# EAGLE design BleAx_nRF52832 (EAGLE 8.0.1)

## Sheet 1 of 2
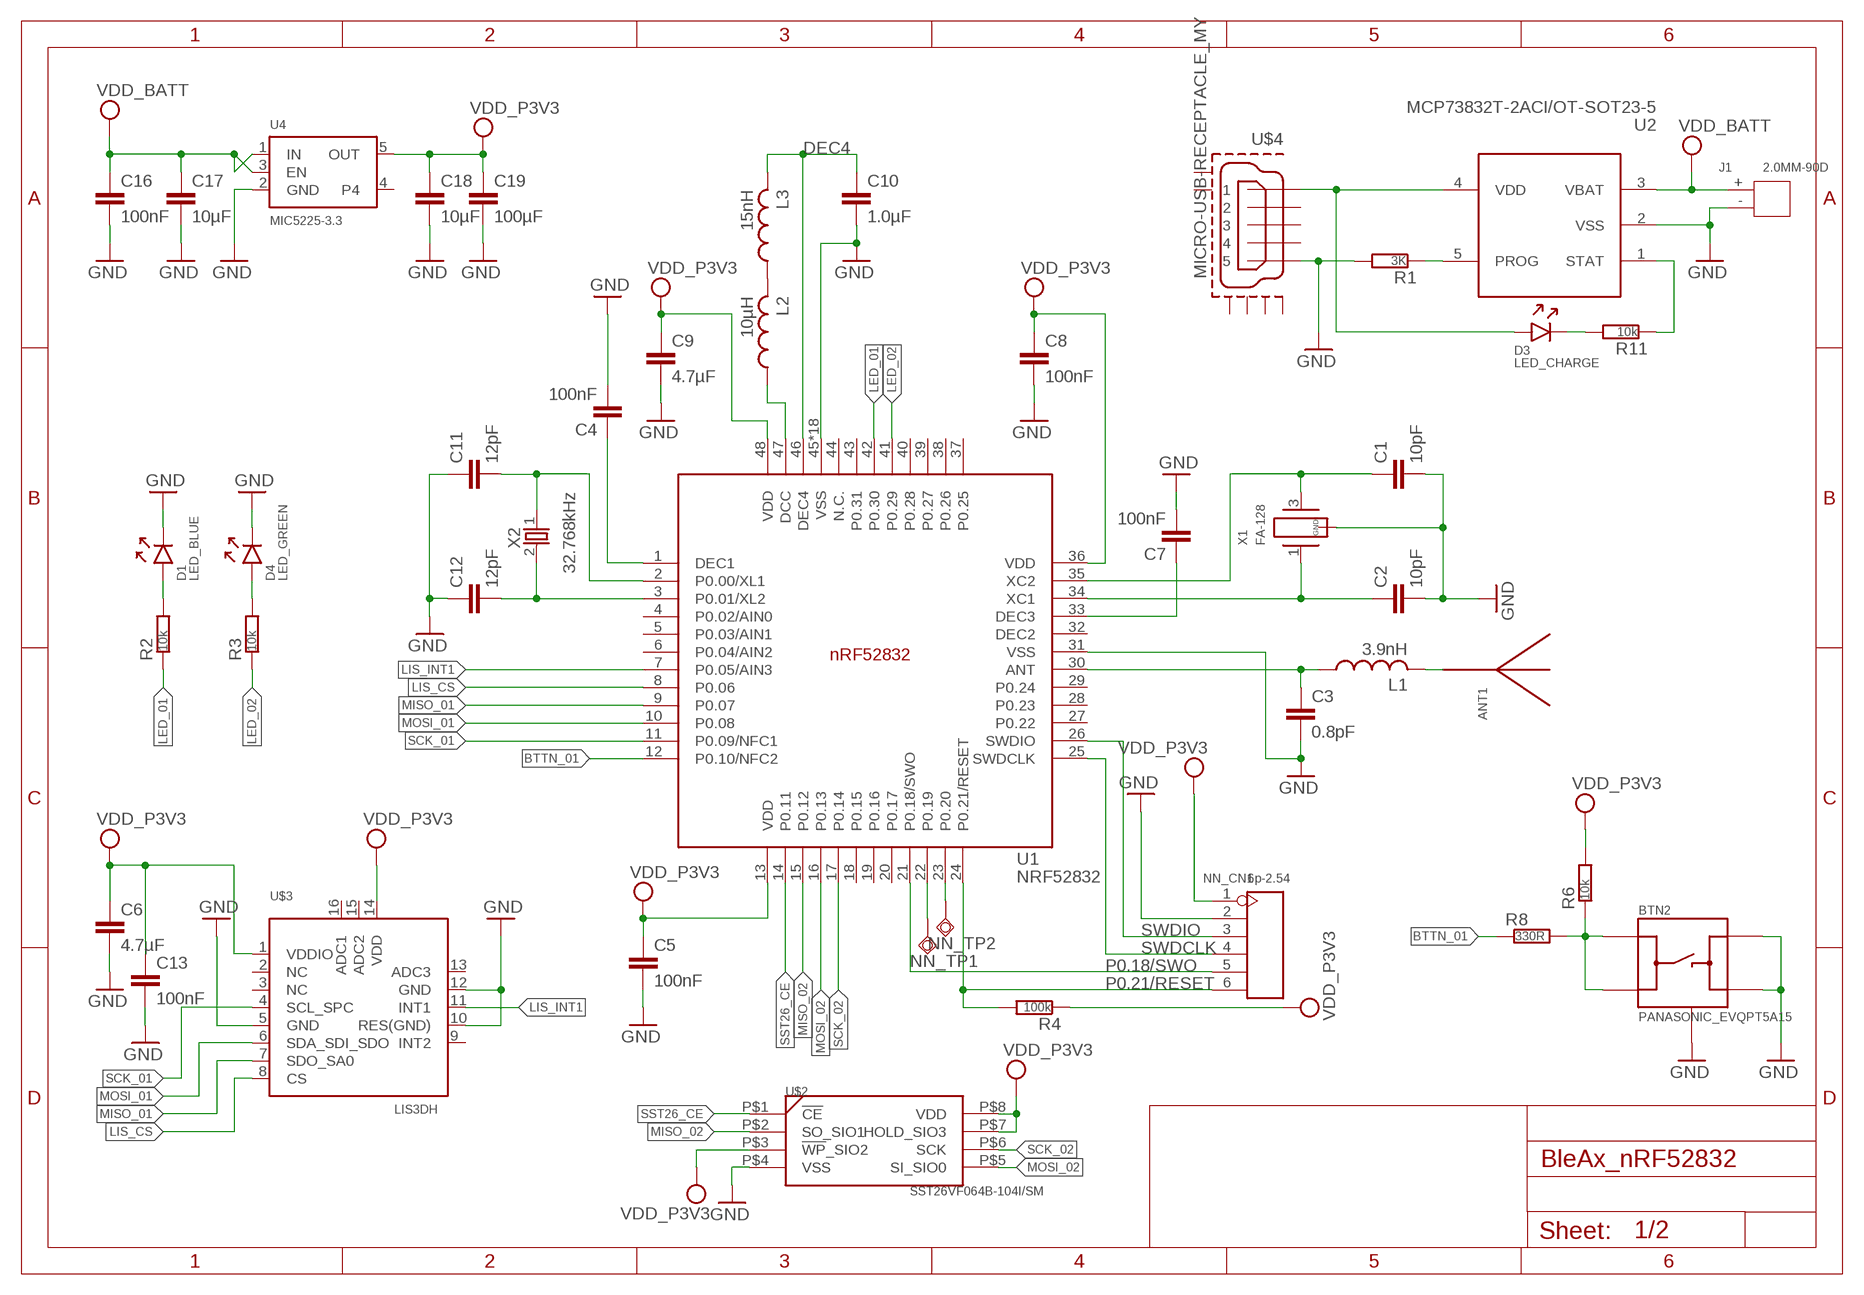
[diagram p0: schematic, sheet 1]

### Parts
ANT1  ANTENNA_QUARTER-WAVE_MONOPOLE_MEANDERED_LEFT  [QWMP_MEANDERED_LEFT_+6]
BTN2  PANASONIC_EVQPT5A15  [PANASONIC_EVQPT5A15]
C1  10pF  CAPACITOR_0402_N  [RESC0402_N]
C2  10pF  CAPACITOR_0402_N  [RESC0402_N]
C3  0.8pF  CAPACITOR_0402_N  [RESC0402_N]
C4  100nF  CAPACITOR_0402_N  [RESC0402_N]
C5  100nF  CAPACITOR_0402_N  [RESC0402_N]
C6  4.7µF  CAPACITOR_0603_N  [RESC0603_N]
C7  100nF  CAPACITOR_0402_N  [RESC0402_N]
C8  100nF  CAPACITOR_0402_N  [RESC0402_N]
C9  4.7µF  CAPACITOR_0603_N  [RESC0603_N]
C10  1.0µF  CAPACITOR_0603_N  [RESC0603_N]
C11  12pF  CAPACITOR_0402_N  [RESC0402_N]
C12  12pF  CAPACITOR_0402_N  [RESC0402_N]
C13  100nF  CAPACITOR_0402_N  [RESC0402_N]
C16  100nF  CAPACITOR_0402_N  [RESC0402_N]
C17  10µF  CAPACITOR_0603_N  [RESC0603_N]
C18  10µF  CAPACITOR_0603_N  [RESC0603_N]
C19  100µF  CAPACITOR_0805_N  [RESC0805_N]
D1  LED_BLUE  LED  [DIOC0603_N]
D3  LED_CHARGE  LED  [DIOC0603_N]
D4  LED_GREEN  LED  [DIOC0603_N]
J1  2.0MM-90D  CONN-HEADER-PH-SIDE-(2P-2.0MM)'90D'  [H2-2.0-90D]
L1  3.9nH  INDUCTOR_0402_N  [RESC0402_N]
L2  10µH  INDUCTOR_0603_N  [RESC0603_N]
L3  15nH  INDUCTOR_0402_N  [RESC0402_N]
NN_CN1  6p-2.54  DIP-BLACK-FEMALE-HEADER-VERT(6P-2.54)  [H6-2.54]
NN_TP1  TPSQTP08R  [TP08R]
NN_TP2  TPSQTP08R  [TP08R]
R1  3K  RESISTOR_0402_N  [RESC0402_N]
R2  10k  RESISTOR_0402_N  [RESC0402_N]
R3  10k  RESISTOR_0402_N  [RESC0402_N]
R4  100k  RESISTOR_0402_N  [RESC0402_N]
R6  10k  RESISTOR_0402_N  [RESC0402_N]
R8  330R  RESISTOR_0402_N  [RESC0402_N]
R11  10k  RESISTOR_0402_N  [RESC0402_N]
U1  NRF52832  [QFN40P600X600X90-48_N]
U2  MCP73832T-2ACI/OT-SOT23-5  PMIC-MCP73832T-2ACI/OT(SOT23-5)  [SOT-23-5]
U4  MIC5225-3.3  VREG_SOT23-5  [SOT23-5]
U$2  SST26VF064B-104I/SM  SST26VF  [SOIJ8]
U$3  LIS3DH  ACCEL_LIS3DHTR  [LGA16_3X3MM]
U$4  MICRO-USB-RECEPTACLE_MY  [47589-0001_MY]
X1  FA-128  [FA-128]
X2  32.768kHz  XTAL_32KHZ  [XTAL_3215_N]

### Nets
ANT: C3.1 L1.1 U1.30(ANT)
BTTN_01: R8.1 U1.12(P0.10/NFC2)
DEC3: C7.1 U1.33(DEC3)
DEC4: C10.1 L3.2 U1.46(DEC4)
GND: BTN2.3(B) BTN2.4(B') BTN2.5(GND) BTN2.6(GND) C1.2 C2.2 C3.2 C4.2 C5.2 C6.2 C7.2 C8.2 C9.2 C10.2 C11.1 C12.1 C13.2 C16.2 C17.2 C18.2 C19.2 D1.1(C) D4.1(C) J1.- NN_CN1.2 R1.2 U1.31(VSS) U1.45(VSS) U1.PAD(VSS) U1.PAD@VIA01(VSS) U1.PAD@VIA02(VSS) U1.PAD@VIA03(VSS) U1.PAD@VIA04(VSS) U1.PAD@VIA05(VSS) U1.PAD@VIA06(VSS) U1.PAD@VIA07(VSS) U1.PAD@VIA08(VSS) U1.PAD@VIA09(VSS) U1.PAD@VIA10(VSS) U1.PAD@VIA11(VSS) U1.PAD@VIA12(VSS) U1.PAD@VIA13(VSS) U1.PAD@VIA14(VSS) U1.PAD@VIA15(VSS) U1.PAD@VIA16(VSS) U2.2(VSS) U4.2(GND) U$2.P$4(VSS) U$3.5(GND) U$3.10(RES(GND)) U$3.12(GND) U$4.5 X1.2(GND) X1.4(GND)
LED_01: R2.1 U1.42(P0.30)
LED_02: R3.1 U1.41(P0.29)
LIS_CS: U1.8(P0.06) U$3.8(CS)
LIS_INT1: U1.7(P0.05/AIN3) U$3.11(INT1)
MISO_01: U1.9(P0.07) U$3.7(SDO_SA0)
MISO_02: U1.15(P0.12) U$2.P$2(SO_SIO1)
MOSI_01: U1.10(P0.08) U$3.6(SDA_SDI_SDO)
MOSI_02: U1.16(P0.13) U$2.P$5(SI_SIO0)
N$1: R1.1 U2.5(PROG)
N$2: L2.2 L3.1
N$3: C1.1 U1.35(XC2) X1.3
N$4: L2.1 U1.47(DCC)
N$5: ANT1.P$1 L1.2
N$6: BTN2.1(A) BTN2.2(A') R6.1 R8.2
N$7: D1.2(A) R2.2
N$8: D4.2(A) R3.2
N$9: D3.1(C) R11.2
N$10: R11.1 U2.1(STAT)
N$11: NN_TP1.TP U1.22(P0.19)
N$12: NN_TP2.TP U1.23(P0.20)
N$13: C4.1 U1.1(DEC1)
P0.18/SWO: NN_CN1.5 U1.21(P0.18/SWO)
P0.21/RESET: NN_CN1.6 R4.2 U1.24(P0.21/RESET)
SCK_01: U1.11(P0.09/NFC1) U$3.4(SCL_SPC)
SCK_02: U1.17(P0.14) U$2.P$6(SCK)
SST26_CE: U1.14(P0.11) U$2.P$1(!CE)
SWDCLK: NN_CN1.4 U1.25(SWDCLK)
SWDIO: NN_CN1.3 U1.26(SWDIO)
VCC_P5V0_USB: D3.2(A) U2.4(VDD) U$4.1
VDD_BATT: C16.1 C17.1 J1.+ U2.3(VBAT) U4.1(IN) U4.3(EN)
VDD_P3V3: C5.1 C6.1 C8.1 C9.1 C13.1 C18.1 C19.1 NN_CN1.1 R4.1 R6.2 U1.13(VDD) U1.36(VDD) U1.48(VDD) U4.5(OUT) U$2.P$3(!WP!_SIO2) U$2.P$7(HOLD_SIO3) U$2.P$8(VDD) U$3.1(VDDIO) U$3.14(VDD)
X1: C2.1 U1.34(XC1) X1.1
XL1: C11.2 U1.2(P0.00/XL1) X2.1
XL2: C12.2 U1.3(P0.01/XL2) X2.2
Unconnected: U1.4(P0.02/AIN0) U1.5(P0.03/AIN1) U1.6(P0.04/AIN2) U1.18(P0.15) U1.19(P0.16) U1.20(P0.17) U1.27(P0.22) U1.28(P0.23) U1.29(P0.24) U1.32(DEC2) U1.37(P0.25) U1.38(P0.26) U1.39(P0.27) U1.40(P0.28) U1.43(P0.31) U1.44(N.C.) U4.4 U$3.2(NC) U$3.3(NC) U$3.9(INT2) U$3.13(ADC3) U$3.15(ADC2) U$3.16(ADC1) U$4.2 U$4.3 U$4.4 U$4.P$1(GND1) U$4.P$2(GND2) U$4.P$3(GND3) U$4.P$4(GND4) U$4.P$5(GND5) U$4.P$6(GND6)

## Sheet 2 of 2
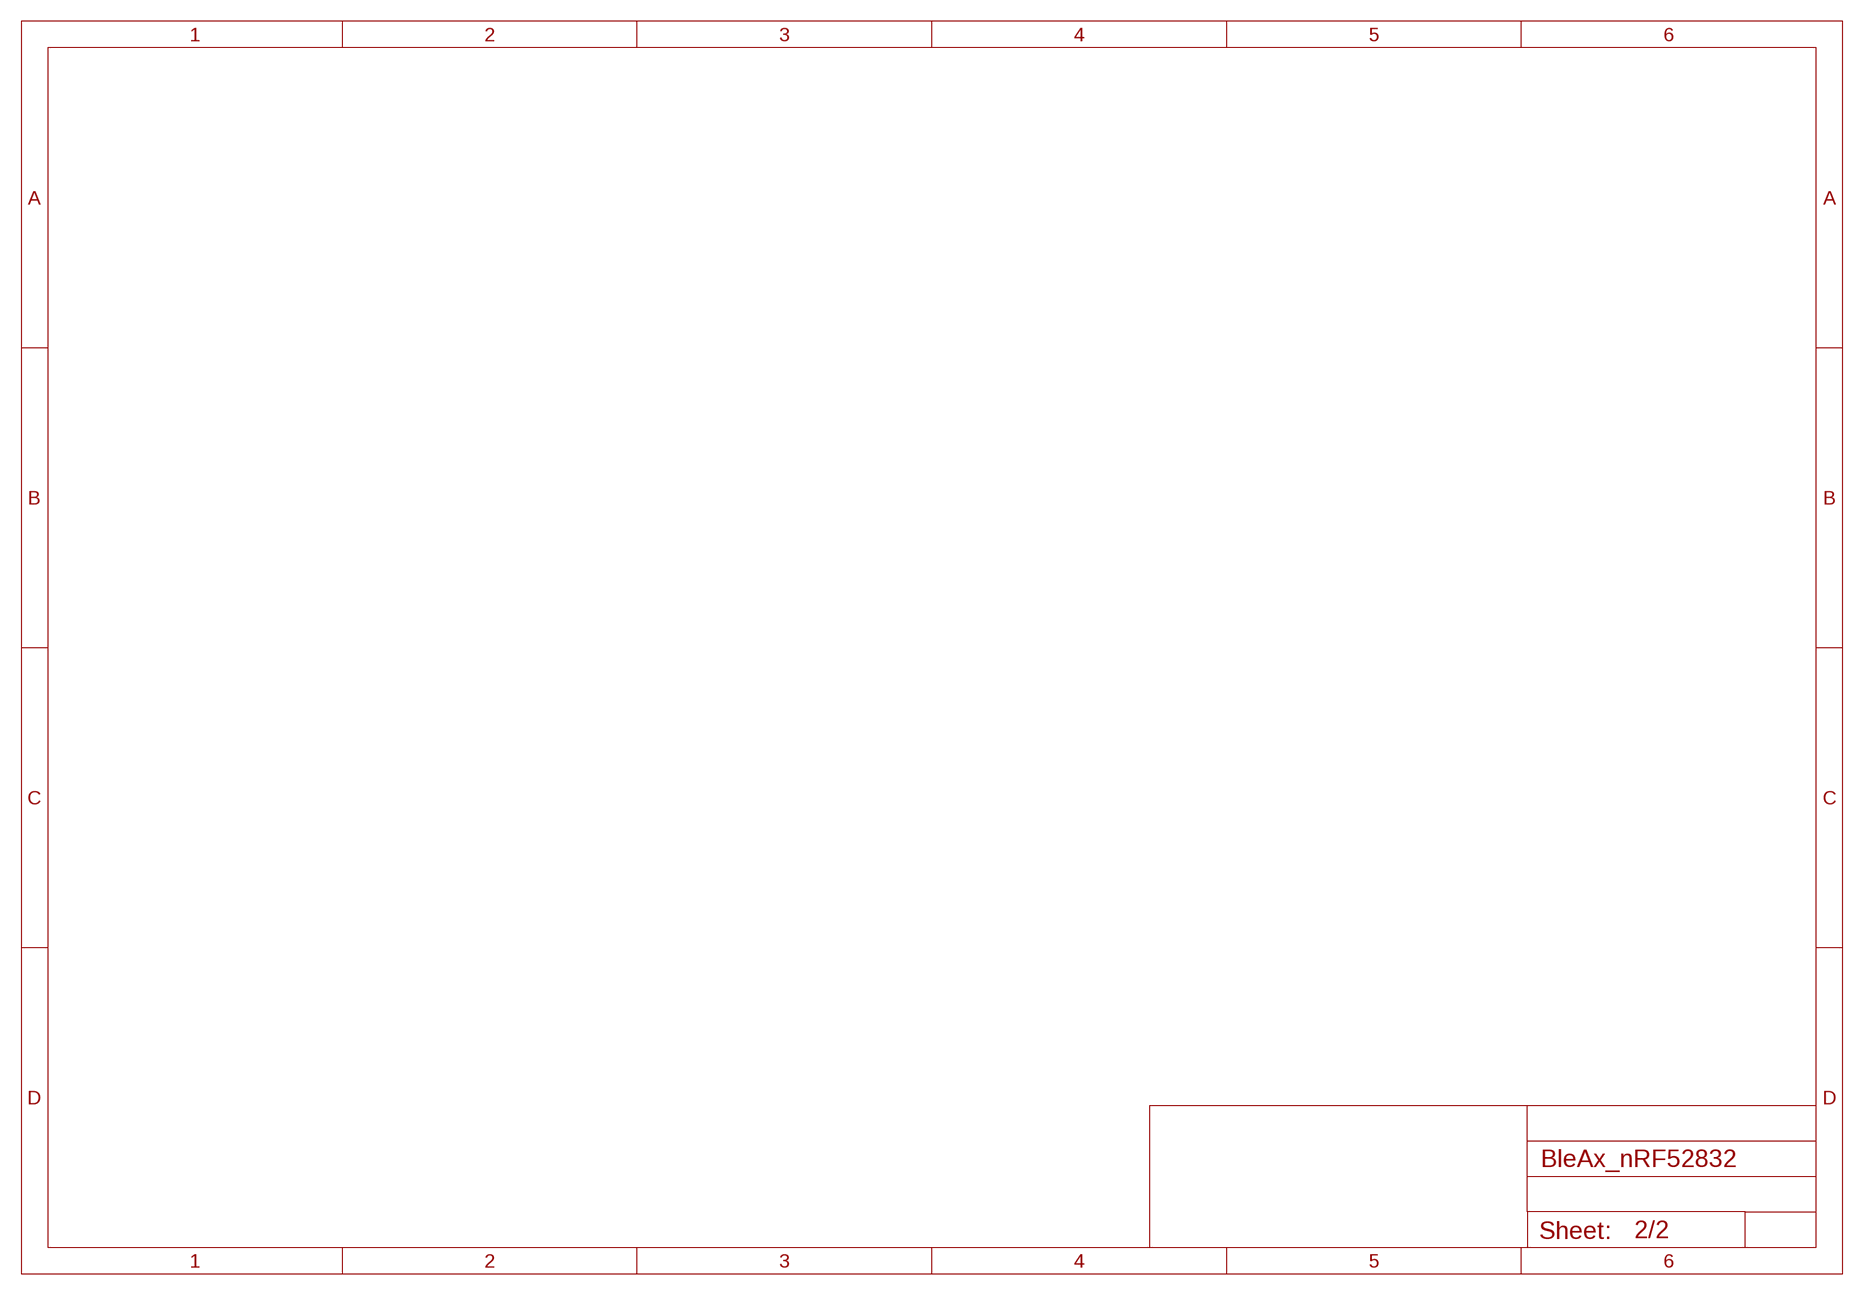
[diagram p1: schematic, sheet 2]

## Library data of the parts
ANT1 = Nordic_misc:ANTENNA_QUARTER-WAVE_MONOPOLE_MEANDERED_LEFT
BTN2 = Nordic_misc:PANASONIC_EVQPT5A15
C1-C13 C16-C19 = Nordic_misc:CAPACITOR: Generic chip capacitor
D1 D3 D4 = Nordic_misc:LED
J1 = Seeed-OPL-Connector:CONN-HEADER-PH-SIDE-(2P-2.0MM): 320110027
L1-L3 = Nordic_misc:INDUCTOR: Generic chip inductor
NN_CN1 = Seeed-OPL-Connector:DIP-BLACK-FEMALE-HEADER-VERT(6P-2.54): 320030060; MPN: F185-1106A1BSYC1
NN_TP1 NN_TP2 = testpad:TPSQ: Test pad
R1-R4 R6 R8 R11 = Nordic_misc:RESISTOR: Generic chip resistor
U1 = Nordic_nRF:NRF52832: nRF52832 Features Single chip, highly flexible, 2.4 GHz multi-protocol SoC 32-bit ARM Cortex-M4F Processor 1.7v to 3.6v operation 512kB flash + 64kB RAM Supports concurrent Bluetooth Smart/ANT protocol operation On-chip NFC tag for Out-of-Band (OOB) pairing Up to +4dBm output power -96dBm sensitivity, Bluetooth Smart Thread safe and run-time protected Event driven API On air compatible with nRF24L and nRF24AP series 2 data rates (2Mbps/1Mbps) PPI - maximum flexibility for power-efficient applications and code simplification Automated power management system with automatic power management of each peripheral Configurable I/O mapping for analog and digital I/O 3 x Master/Slave SPI 2 x Two-wire interface (I²C) UART (RTS/CTS) 3 x PWM AES HW encryption Real Time Counter (RTC) Digital microphone interface (PDM) On-chip balun Applications Internet of Things (IoT) Wearables SmartHome sensors Connected white goods Computer peripherals Voice-command smart remotes A4WP ‘Rezence’ wireless charging Beacons Sports and fitness sensors and hubs Connected health products Smart watches RC Toys Interactive games Building automation and sensor networks
U2 = Seeed-OPL-ic:PMIC-MCP73832T-2ACI/OT(SOT23-5): 310030238; MPN: MCP73832T-2ACI/OT
U4 = microbuilder:VREG_SOT23-5: SOT23-5 Fixed Voltage Regulators To better organise some of the SOT23-5 fixed voltage regulators in this library, this new part was created. Part Current Out V Out V In V Dropout Digikey Part No. ADP121 150mA 3.3V 3.4-5.5V 0.09V @ 150mA ADP121-AUJZ33R7CT-ND ADP121 150mA 3.0V 3.1-5.5V 0.09V @ 150mA ADP121-AUJZ30R7CT-ND ADP122 300mA 3.3V 3.4-5.5V 0.085V @ 300mA ADP122AUJZ-3.3-R7CT-ND ADP1712 300mA 3.3V 3.5-5.5V 0.17V @ 300mA ADP1712AUJZ-3.3-R7TR-ND AP7311 (Low Cost) 150mA 3.3V 3.5-6V 0.15V @ 150mA AP7311-33WG-7DICT-ND LD39015M18R 150mA 1.8V 1.9V-5.5V 0.08V @ 100mA 497-6977-1-ND MCP1824T-3302E/OT 300mA 3.3V 3.5V-6V 0.2V @ 300mA MCP1824T-3302E/OTCT-ND MIC5205-2.5YM5 TR 150mA 2.5V 2.7-16V 0.165V @ 150mA 576-1257-2-ND MIC5205-3.0YM5 TR 150mA 3.0V 3.2V-16V 0.165V @ 150mA 576-1258-2-ND MIC5205-3.3YM5 TR 150mA 3.3V 3.5V-16V 0.165V @ 150mA 576-1259-2-ND TPS780330220 150mA 3.3V+2.2V 3.6-5.5V 250mV Max 296-23332-1-ND TDA3663/N1,135 100mA 3.3V 3.5-45V 0.18V @ 50mA 568-5343-1-ND
U$2 = sst26:SST26VF: SST26VF SST26
U$3 = microbuilder:ACCEL_LIS3DHTR: LIS3DHTR 3-Axis Accelerometer with I2C/SPI Interface VDD: 1.71-3.6V VDDIO: 1.71-VDD+0.1V Scale: +/-2g, 4g, 8g, 16g with 16--bit data output Temp:: -40°C - 85°C Mouser: 511-LIS3DHTR Digikey: 497-10613-1-ND
U$4 = con-molex-usb_my:MICRO-USB-RECEPTACLE_MY: MICRO USB RECEPTACLES Micro-USB Receptacles, SMT, Lead-Free from MOLEX <http://www.molex.com/>. (C) 2014 Tomasz Boleslaw CEDRO, cederom@tlen.pl, http://www.tomek.cedro.info. Version 0.1 (2014-01-17): Initial release. Version 0.2 (2014-02-06): Updated 47589-0001 footprint pins/pads/milling. Following devices are included: 1. 47589-0001 Micro-USB AB Receptacle, Bottom Mount, SMT, Lead-Free <http://www.molex.com/molex/products/datasheet.jsp?part=active/0475890001_IO_CONNECTORS.xml> (Technical Drawing <http://www.molex.com/pdm_docs/sd/475890001_sd.pdf>).
X1 = crystals:FA-128: Epson MHz RANGE CRYSTAL UNIT ULTRA MINIATURE SIZE LOW PROFILE SMD http://www.digikey.com/product-search/en?FV=ffec63d1
X2 = Nordic_nRF:XTAL_32KHZ

## Net classes
0 default: clearance 0.205 mm

## Board
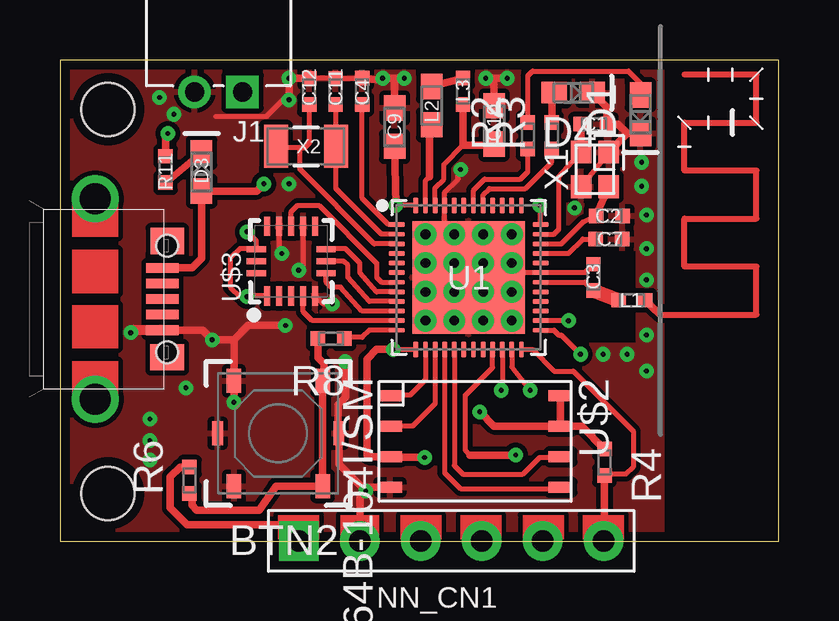
[diagram p2: board, top side]
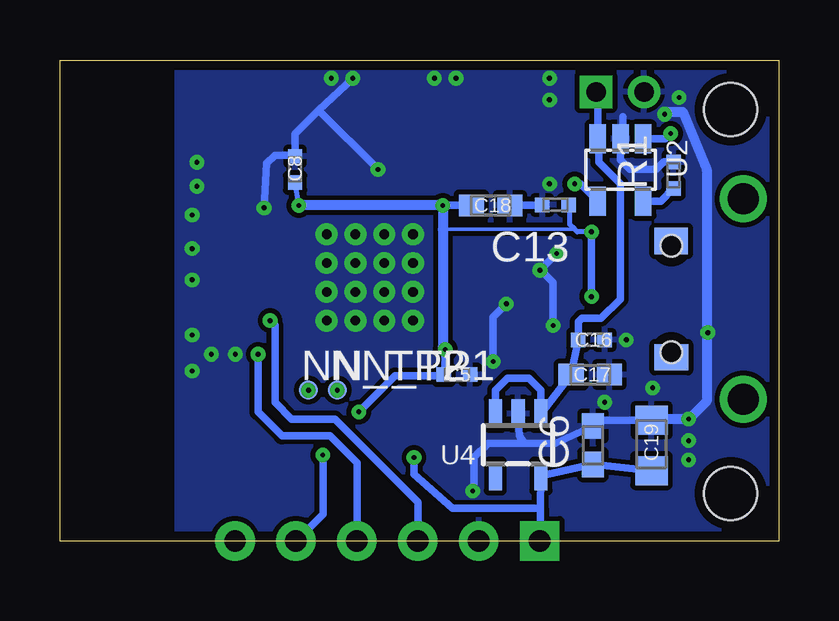
[diagram p3: board, bottom side, seen from below]

Size 29.96 x 20.06 mm. Coordinates in mm from the lower left corner, seen from the top.
Outline: 0,0 29.96,0 29.96,20.06 0,20.06 0,0
Copper layers (1*16): Top 0.035mm / dielectric 1.5mm / Bottom 0.035mm
Design rules "Nordic *": minimum track width 0.15mm, minimum drill 0.2mm, track to track 0.15mm, track to pad 0.15mm, pad to pad 0.15mm, via to via 0.15mm, smd to smd 0.15mm, copper to edge 0.4mm, drill to drill 0.4mm, minimum pad ring 10mil, minimum via ring 8mil, stop-mask expansion 0.1mm, vias tented up to drill 0.41mm, thermal gap 0.2mm
Holes 2.2 mm at 2,18 2,2
tRestrict: area 19.4,8.3 to 23,12.1; area 23,8.3 to 24,12.1

### Footprints (pad centres in the part's own frame; a part is rotated, then mirrored left to right if it is on the bottom)
QWMP_MEANDERED_LEFT_+6 = smd 0.254 x 0.254: P$1 0,0
PANASONIC_EVQPT5A15 = smd 0.6 x 1: 1 -1.85,2.2; 2 -1.85,-2.2; 3 1.85,2.2; 4 1.85,-2.2 | smd 0.45 x 1: 5 -2.525,0; 6 2.525,0
RESC0402_N = smd 0.6 x 0.6: 1 -0.55,0; 2 0.55,0
RESC0603_N = smd 1.05 x 0.9: 1 -0.8,0; 2 0.8,0
RESC0805_N = smd 1.2 x 1.35: 1 -1.1,0; 2 1,0
DIOC0603_N = smd 1.05 x 0.9: 1 -0.8,0; 2 0.8,0
H2-2.0-90D = drill 0.8 pad 1.35 square: + -1,3.25 | drill 0.8 pad 1.35: - 1,3.25
H6-2.54 = drill 0.889 pad 1.651 square: 1 0,6.35 | drill 0.889 pad 1.651: 2 0,3.81; 3 0,1.27; 4 0,-1.27; 5 0,-3.81; 6 0,-6.35
TP08R = smd 0.8 x 0.8: TP 0,0
QFN40P600X600X90-48_N = smd 0.65 x 0.2: 1 -3,2.2; 2 -3,1.8; 3 -3,1.4; 4 -3,1; 5 -3,0.6; 6 -3,0.2; 7 -3,-0.2; 8 -3,-0.6; 9 -3,-1; 10 -3,-1.4; 11 -3,-1.8; 12 -3,-2.2; 25 3,-2.2; 26 3,-1.8; 27 3,-1.4; 28 3,-1; 29 3,-0.6; 30 3,-0.2; 31 3,0.2; 32 3,0.6; 33 3,1; 34 3,1.4; 35 3,1.8; 36 3,2.2 | smd 0.2 x 0.65: 13 -2.2,-3; 14 -1.8,-3; 15 -1.4,-3; 16 -1,-3; 17 -0.6,-3; 18 -0.2,-3; 19 0.2,-3; 20 0.6,-3; 21 1,-3; 22 1.4,-3; 23 1.8,-3; 24 2.2,-3; 37 2.2,3; 38 1.8,3; 39 1.4,3; 40 1,3; 41 0.6,3; 42 0.2,3; 43 -0.2,3; 44 -0.6,3; 45 -1,3; 46 -1.4,3; 47 -1.8,3; 48 -2.2,3 | smd 4.7 x 4.7: PAD 0,0 | drill 0.4: PAD@VIA01 -1.8,1.8; PAD@VIA02 -1.8,0.6; PAD@VIA03 -1.8,-0.6; PAD@VIA04 -1.8,-1.8; PAD@VIA05 -0.6,1.8; PAD@VIA06 -0.6,0.6; PAD@VIA07 -0.6,-0.6; PAD@VIA08 -0.6,-1.8; PAD@VIA09 0.6,1.8; PAD@VIA10 0.6,0.6; PAD@VIA11 0.6,-0.6; PAD@VIA12 0.6,-1.8; PAD@VIA13 1.8,1.8; PAD@VIA14 1.8,0.6; PAD@VIA15 1.8,-0.6; PAD@VIA16 1.8,-1.8
SOT-23-5 = smd 0.69 x 1.2: 1 -0.95,-1.3; 2 0,-1.3; 3 0.95,-1.3; 4 0.95,1.3; 5 -0.95,1.3
SOT23-5 = smd 0.55 x 1.2: 1 -0.95,-1.3; 2 0,-1.3; 3 0.95,-1.3; 4 0.95,1.3; 5 -0.95,1.3
SOIJ8 = smd 0.45 x 1: P$1 -1.97,-3.73; P$2 -0.7,-3.73; P$3 0.57,-3.73; P$4 1.84,-3.73; P$5 1.84,3.37; P$6 0.57,3.37; P$7 -0.7,3.37; P$8 -1.97,3.37
LGA16_3X3MM = smd 0.8 x 0.25: 1 -1.45,1; 2 -1.45,0.5; 3 -1.45,0; 4 -1.45,-0.5; 5 -1.45,-1; 9 1.45,-1; 10 1.45,-0.5; 11 1.45,0; 12 1.45,0.5; 13 1.45,1 | smd 0.25 x 0.8: 6 -0.5,-1.45; 7 0,-1.45; 8 0.5,-1.45; 14 0.5,1.45; 15 0,1.45; 16 -0.5,1.45
47589-0001_MY = smd 1.35 x 0.4: 1 4.07,1.3; 2 4.07,0.65; 3 4.07,0; 4 4.07,-0.65; 5 4.07,-1.3 | drill 1.3: P$1 1.27,4.175; P$2 1.27,-4.175 | smd 1.4 x 1.1: P$3 4.27,-2.425; P$4 4.275,2.42 | smd 1.4 x 1.1 bottom: P$5 4.27,-2.425; P$6 4.275,2.42 | hole 0.9: 4.275,2.22; 4.27,-2.225
FA-128 = smd 0.95 x 0.85: 1 -0.725,-0.575; 2 0.725,-0.575; 3 0.725,0.575; 4 -0.725,0.575
XTAL_3215_N = smd 1 x 1.8: 1 -1.25,0; 2 1.25,0

### Placement (x,y rotation side)
ANT1  25.04,9.45 0 top
BTN2  9.1,4.5 180 top
C1  22.25,17.39 0 top
C2  22.9,13.56 0 top
C3  22.24,11 90 top
C4  12.6,18.76 90 top
C5  13.41,6.95 0.1 bottom
C6  7.74,4.01 90 bottom
C7  22.89,12.6 0 top
C8  20.16,15.5 90 bottom
C9  13.95,17.26 90 top
C10  18.1,17.36 90 top
C11  11.49,18.75 270 top
C12  10.39,18.75 270 top
C13  9.3,14.02 180 bottom
C16  7.8,8.4 0 bottom
C17  7.85,6.95 0 bottom
C18  12,14 0 bottom
C19  5.3,4.05 90 bottom
D1  24.2,17.8 90 top
D3  5.9,15.4 270 top
D4  21.4,18.7 180 top
J1  6.61,21.98 180 top
L1  23.84,10.05 0 top
L2  15.5,18.16 90 top
L3  16.8,18.76 270 top
NN_CN1  16.31,0.02 90 top
NN_TP1  18.4,6.3 0 bottom
NN_TP2  19.6,6.3 0 bottom
R1  4.38,15.26 90 bottom
R2  19.5,16.9 90 top
R3  20.5,16.9 90 top
R4  22.7,3.3 270 top
R6  5.4,2.55 90 top
R8  11.3,8.45 180 top
R11  4.4,15.5 270 top
U1  17.04,11 0 top
U2  6.59,15.48 180 bottom
U4  10.86,4.03 180 bottom
U$2  17.5,4.1 270 top
U$3  9.64,11.68 90 top
U$4  0.2,10.1 0 top
X1  22.3,15.5 90 top
X2  10.25,16.46 180 top

### Tracks (layer width: path | path; a pad name or v marks a point on that pad's centre or on a via)
ANT
  Top 0.2: U1.30 21.89,10.8 C3.1
  Top 0.61: C3.1 L1.1
BTTN_01
  Top 0.2: U1.12 12.9,8.8 12.6,8.5 11.9,8.5 R8.1
DEC3
  Top 0.15: 20,12 U1.33
  Top 0.2: U1.33 21.2,12 21.8,12.6 C7.1
DEC4
  Top 0.2: U1.46 15.64,14.74 16,15.1 16,15.7 16.8,16.5
  Top 0.305: L3.2 16.8,16.5 18.04,16.5 C10.1
GND  (via drill 0.2)
  Top 0.15: U1.PAD 17.5,11 17.5,11.5 U1.PAD@VIA10
  Top 0.2: X1.2 X1.4 | C3.2 21.89,11.2 U1.31 19.24,11.2 U1.PAD@VIA14 | C12.1 C11.1 C4.2 | U$3.10 10.14,11.49 v9.95,11.3 | U$3.12 9.14,12.11 v9.25,12 | U$3.5 10.97,9.9 v11.35,9.9 | U1.PAD@VIA05 16.14,13.1 15.9,13.1 16.04,13.24 U1.45 16.04,14.54 16.6,15.1 16.6,15.5 v16.7,15.5 | v9.55,18.4 9.3,18.4 8.6,17.7 6.5,17.7
  Top 0.305: 23.65,17 D1.1 | 23.65,17 X1.2 | 23.65,17 23.26,17.39 C1.2 22.8,18.1 D4.1 | 13.71,2.2 U$2.P$4 12.91,2.26 v12.75,2.1 | v7.25,5.8 BTN2.4 C16.2 | C16.2 v6.35,8.4 5.95,8.8 U$4.5 | C12.1 v9.55,19.3 v9.55,18.4 | C4.2 13.36,19.21 v13.45,19.3 13.9,19.3 | 13.9,19.3 v14.35,19.3 | C9.2 13.95,19.25 13.9,19.3 | v18.65,19.3 v17.75,19.3 18.1,19.05 C10.2 | v9.4,9 7.85,9 C16.2 | v11.9,7.5 11.9,6 11.6,5.7 11.6,4.53 BTN2.5 11.62,3.23 v12.75,2.1 | NN_CN1.2 12.5,1.85 v12.75,2.1
  Top 0.406: U$4.5 3.05,8.8 v2.95,8.7
  Bottom 0.305: 10.6,4.1 9.3,4.1 C6.2 7.5,5.05 C19.2 | 10.6,4.1 10.8,4.4 U4.2 | 6.5,17.7 6.5,16.87 U2.2 6.6,15.9 6.2,15.5 5.1,15.5 4.79,15.81 R1.2 | v21.45,13.9 21.35,15.75 21,16.1 20.21,16.1 C8.2 20.16,16.99 19.18,17.98 | 19.18,17.98 v17.75,19.3 | C18.2 9.87,14 C13.2 | v9.4,9 9.4,10.8 9.9,11.3 v9.95,11.3 v9.25,12 | v12.75,2.1 12.7,2.15 12.7,3.5 12.1,4.1 10.6,4.1 | v11.35,9.9 11.9,9.35 v11.9,7.5 | v16.7,15.5 19.18,17.98
  Bottom 0.406: 4.78,17.9 4,17.9 3,15.49 3,5.85 v3.75,5.1 5.25,5.1 C19.2
  other vias: 3.75,3.4 3.75,4.2 24.25,15.8 24.25,14.8 24.45,13.6 24.45,10.9 24.45,12.2 24.45,7.1 22.65,7.8 23.65,7.8 24.45,8.6 5.25,6.4 4.15,18.5 4.75,17.8 9.55,14.9
  pour Bottom: 0,0 0,20.06 25.1,19.96 25.1,0
  pour Top: 0,0 0,20.06 25.1,19.96 25.1,0
LED_01
  Top 0.2: U1.42 17.24,14.64 17.7,15.1 19.2,15.1 19.5,15.4 R2.1
LED_02
  Top 0.2: U1.41 17.64,14.44 17.9,14.7 19.4,14.7 20.5,15.8 R3.1
LIS_CS
  Top 0.2: U1.8 13.2,10.4 12.5,11.2 12.5,11.6 11.9,12.2 11.11,12.2 U$3.8
LIS_INT1
  Top 0.2: U$3.11 9.64,13.74 9.9,14 10.8,14 13.2,11.6 13.2,11 13.4,10.8 U1.7
MISO_01
  Top 0.2: U1.9 12.9,10 12,11 12,11.5 11.82,11.68 U$3.7
MISO_02
  Top 0.2: U1.15 15.64,5.74 14.7,4.8 U$2.P$2
MOSI_01
  Top 0.2: U1.10 12.6,9.6 11.7,10.6 11.3,10.6 11.1,10.8 U$3.6
MOSI_02
  Top 0.2: U1.16 16.04,2.86 16.7,2.2 20.81,2.2 U$2.P$5
N$1
  Bottom 0.305: R1.1 4.91,14.18 U2.5
N$2
  Top 0.305: L2.2 L3.1
N$3
  Top 0.2: U1.35 20.6,12.8 20.8,13 20.8,15.2 X1.3
  Top 0.305: X1.3 21.73,17.36 C1.1
N$4
  Top 0.2: U1.47 15.24,15.04 15.4,15.2
  Top 0.305: 15.4,15.2 15.4,17.26 L2.1
N$5
  Top 0.305: L1.2 ANT1.P$1
N$6
  Top 0.305: R6.1 5.5,1.9 5.5,1.5 5.7,1.3 8.3,1.3 9,2.3 BTN2.1 BTN2.2 11,6.75 11,7.4 10.75,7.65 R8.2
N$7
  Top 0.2: R2.2 19.5,19.4 19.7,19.6 23.7,19.6 24.2,19.1 D1.2
N$8
  Top 0.15: D4.2 20.5,18.5
  Top 0.305: R3.2 20.5,18.6 D4.2
N$9
  Top 0.305: R11.2 D3.1
N$10  (via drill 0.2)
  Top 0.305: R11.1 4.4,16.9 v4.5,17
  Bottom 0.305: U2.1 4.72,16.78 v4.5,17 4.4,17.1
N$11  (via drill 0.2)
  Top 0.2: U1.22 18.44,6.34 NN_TP1.TP
  other vias: 18.4,6.3
N$12  (via drill 0.2)
  Top 0.2: U1.23 18.84,7.26 NN_TP2.TP
  other vias: 19.6,6.3
N$13
  Top 0.2: U1.1 13.7,13.2 12.6,14.3 C4.1
P0.18/SWO  (via drill 0.2)
  Top 0.2: 17.1,3.6 16.9,3.8 16.9,6.1 18.04,7.24 U1.21
  Top 0.305: v19,3.6 17.1,3.6
  Bottom 0.305: NN_CN1.5 19,1.14 v19,3.6
P0.21/RESET
  Top 0.2: U1.24 19.7,8 20.6,7.1 21.4,7.1 23.9,4.6 23.9,3.1 23.6,2.8 22.75,2.8 R4.2
  Top 0.305: R4.2 22.7,0.06 NN_CN1.6
SCK_01
  Top 0.2: U1.11 10.52,9.2 10.14,9.58 U$3.4
SCK_02
  Top 0.2: U1.17 16.44,3.16 16.8,2.8 19.3,2.8 20,3.5 20.84,3.5 U$2.P$6
SST26_CE
  Top 0.2: U1.14 15.24,6.74 14.6,6.1 13.8,6.1 U$2.P$1
SWDCLK  (via drill 0.2)
  Top 0.2: U1.25 20.6,8.8 20.8,8.6 20.9,8.6 v21.7,7.8
  Bottom 0.305: NN_CN1.4 17.58,3.28 18.7,4.4 20.7,4.4 21.7,5.4 v21.7,7.8
SWDIO  (via drill 0.2)
  Top 0.2: v21.2,9.2 U1.26
  Bottom 0.305: NN_CN1.3 15.04,1.64 18.5,5.1 20.3,5.1 21,5.8 21,9 v21.2,9.2
VCC_P5V0_USB  (via drill 0.2)
  Top 0.305: v8.5,14.9 8.2,14.6 D3.2 5.9,11.8 5.5,11.4 U$4.1
  Bottom 0.305: v8.5,14.9 8.26,14.9 U2.4
VDD_BATT
  Bottom 0.305: J1.+ 7.54,18.66 U2.3 7.5,16.74 7.5,15.8 6.6,14.9 6.6,10.1 7.4,9.3 8.2,9.3 8.35,9.15 C16.1 C17.1 U4.1 9.91,6.31 10.4,6.8 11.3,6.8 11.8,6.3 U4.3
VDD_P3V3  (via drill 0.2)
  Top 0.2: U1.36 20.04,13.96 v20,14 | v13.9,8 U1.13 | v7.8,12.9 8.19,12.51 U$3.14 8.17,12.2 7.5,12.2 7.1,11.8 7.1,10.6 7.5,10.2 v7.8,10.2 7.83,10.23 U$3.1 | U1.48 v14,14
  Top 0.305: v14,14 C9.1 | U$2.P$7 21.75,4.8 R4.1 | U$2.P$8 U$2.P$7 | v13.9,8 13.2,8 12.8,7.6 12.8,3.6 12.87,3.53 U$2.P$3 13.8,3.5 v15.2,3.5 | R6.2 5,3.1 4.6,2.7 4.6,1.4 5.3,0.7 9.48,0.7 NN_CN1.1 | v17.5,5.4 18.1,4.8 U$2.P$7
  Bottom 0.15: 14,13 8.5,13
  Bottom 0.2: v20,14 C8.1 | v7.8,12.9 8.4,12.9 8.5,13 8.7,13.2 8.7,13.97 C13.1
  Bottom 0.305: v7.8,10.2 v7.8,12.9 | v13.9,8 13.9,7.01 C5.1 14.01,6.9 16,6.9 v17.5,5.4 | 9.94,1.39 U4.5 C6.1 C19.1 | 9.94,1.39 NN_CN1.1 | C18.1 v14,14 | v15.2,3.5 15.2,2.8 13.59,1.39 9.94,1.39
  Bottom 0.406: v20,14 v14,14 14,13 14,8.1 v13.9,8
X1
  Top 0.2: U1.34 20.9,12.4 21.8,13.3 C2.1
  Top 0.305: C2.1 X1.1
XL1
  Top 0.2: U1.2 13.4,12.8 11.5,14.7 X2.1 C11.2
XL2
  Top 0.2: C12.2 10.39,16.59 10.2,16.4 10,16.4 | 10,16.4 9.06,16.4 X2.2 | U1.3 13.1,12.4 10,15.5 10,16.4
(copper drawn outside any net)
  shapes: Top area x6